# Altium schematic sheet Dongle.SchDoc
size A4
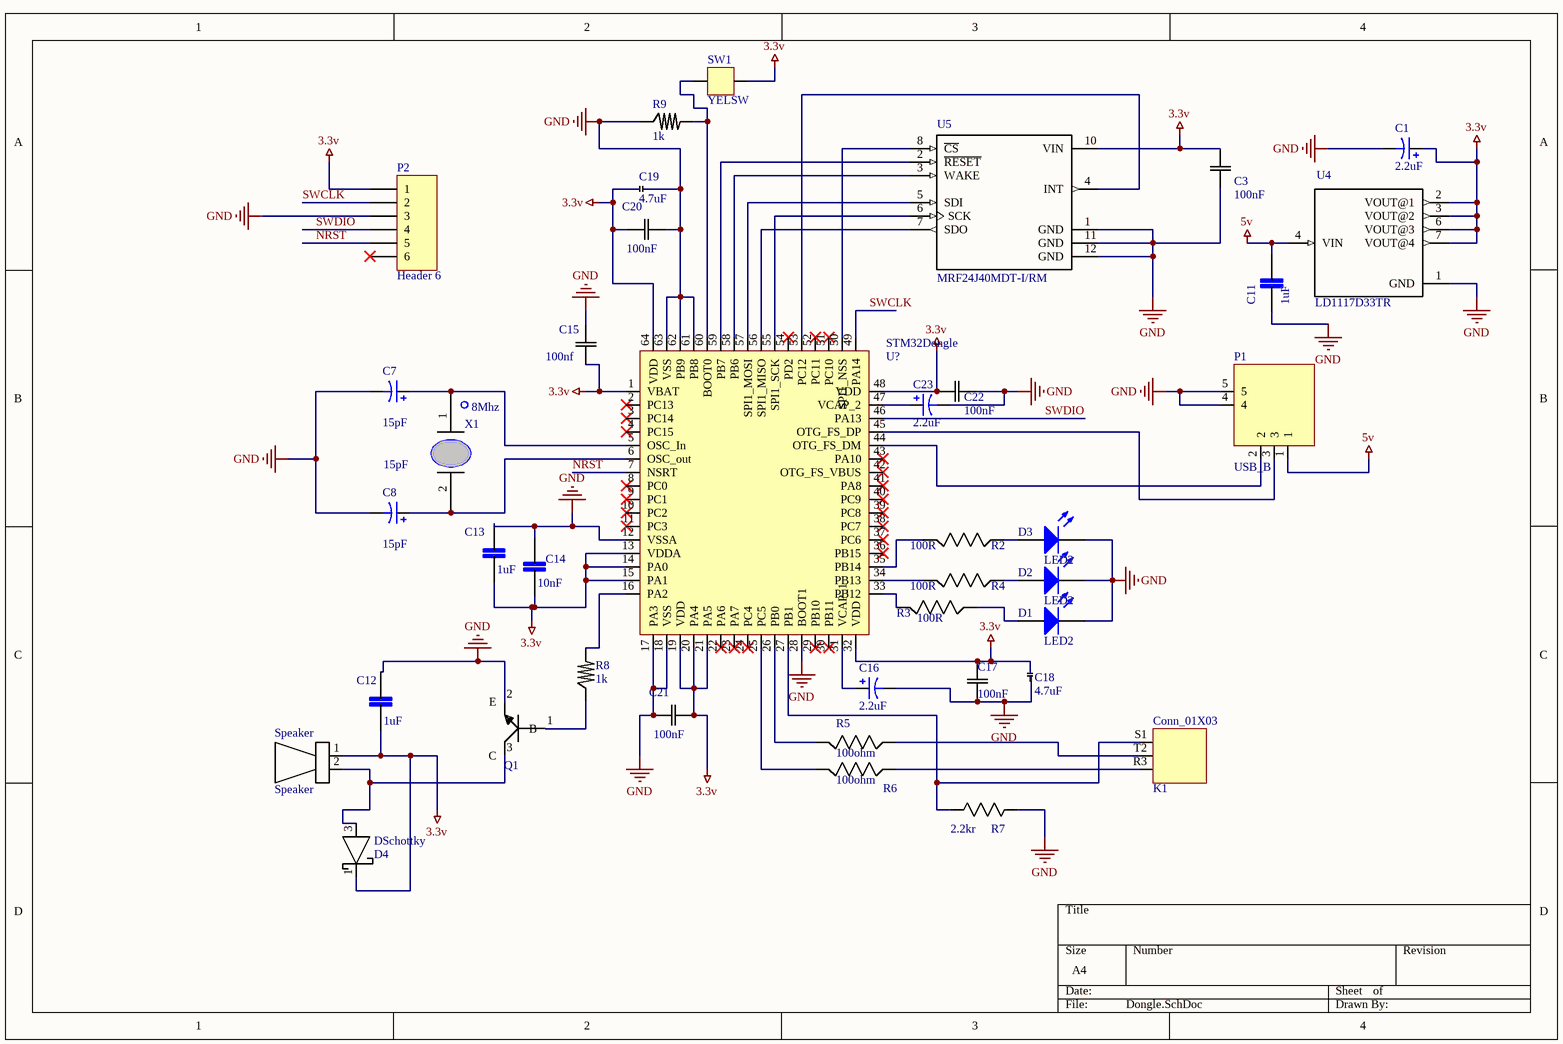
[diagram p0: Dongle.SchDoc]

## Parts
8Mhz  X1  [XTAL_ABLS2-24.000MHZ-D4YF-T]
C1  value 2.2uF  [C0805]  (hidden comment: Cap Pol3)
C3  100nF  [CAPC2013X110N]
C7  15pF  [C0805]
C8  value 15pF  [C0805]  (hidden comment: Cap Pol3)
C11  1uF  [INDC2012X87N]
C12  1uF  [INDC2012X87N]
C13  1uF  [INDC2012X87N]
C14  10nF  [CAPC2012X135N]
C15  100nf  [CAPC2013X110N]
C16  value 2.2uF  [C0805]  (hidden comment: Cap Pol3)
C17  100nF  [CAPC2013X110N]
C18  4.7uF  [0805]
C19  4.7uF  [0805]
C20  100nF  [CAPC2013X110N]
C21  100nF  [CAPC2013X110N]
C22  100nF  [CAPC2013X110N]
C23  value 2.2uF  [C0805]  (hidden comment: Cap Pol3)
Conn_01X03  K1  [PCBComponent_1]
D1  LED2  [3.2X1.6X1.1]
D2  LED2  [3.2X1.6X1.1]
D3  LED2  [3.2X1.6X1.1]
DSchottky  D4  [SOT65P210X110-3N]
P1  USB_B  [PCBComponent_1]
P2  Header 6  [HDR1X6]
Q1  BC846A-7-F  [SOT23-3]  (value not drawn)
R2  100R  [RESC2012X60]
R3  100R  [RESC2012X60]
R4  100R  [RESC2012X60]
R5  100ohm  [RESC2012X60]
R6  100ohm  [RESC2012X60]
R7  2.2kr  [RESC2013X65N]
R8  1k  [CAPC2012X140N]
R9  1k  [CAPC2012X140N]
Speaker  Speaker  [Speaker]
STM32Dongle  U?  [QFP50P1200X1200X160-64N]
SW1  YELSW  [PCBComponent_1]
U4  LD1117D33TR  [SOIC127P600X175-8N]
U5  MRF24J40MDT-I/RM  [XCVR_MRF24J40MDT-I/RM]

## Nets
3.3v: C1.1 C3.1(C1) C12.1 C13.1 C14.1 C15.1(C1) C17.1(C1) C18.P1 C19.P1 C20.1(C1) C21.2(C2) C22.1(C1) DSchottky.1 P2.1 Speaker.1 STM32Dongle.1(VBAT) STM32Dongle.13(VDDA) STM32Dongle.14(PA0) STM32Dongle.15(PA1) STM32Dongle.19(VDD) STM32Dongle.20(PA4) STM32Dongle.21(PA5) STM32Dongle.32(VDD) STM32Dongle.48(VDD) STM32Dongle.64(VDD) SW1.3 U4.2(VOUT@1) U4.3(VOUT@2) U4.6(VOUT@3) U4.7(VOUT@4) U5.10(VIN)
5v: C11.2 P1.1 U4.4(VIN)
GND: C1.2 C3.2(C2) C7.2 C8.2 C11.1 C12.2 C13.2 C14.2 C15.2(C2) C16.2 C17.2(C2) C18.P2 C19.P2 C20.2(C2) C21.1(C1) C22.2(C2) C23.2 D1.2(K) D2.2(K) D3.2(K) P1.4 P1.5 P2.3 Q1.2(E) R7.1(R1) R9.1 STM32Dongle.12(VSSA) STM32Dongle.17(PA3) STM32Dongle.18(VSS) STM32Dongle.28(BOOT1) STM32Dongle.61(PB8) STM32Dongle.62(PB9) STM32Dongle.63(VSS) U4.1(GND) U5.1(GND) U5.11(GND) U5.12(GND)
NRST: P2.5 STM32Dongle.7(NSRT)
SWCLK: P2.2 STM32Dongle.49(PA14)
SWDIO: P2.4 STM32Dongle.46(PA13)
Net8Mhz_1: 8Mhz.1 C7.1 STM32Dongle.5(OSC_In)
Net8Mhz_2: 8Mhz.2 C8.1 STM32Dongle.6(OSC_out)
NetC16_1: C16.1 STM32Dongle.31(VCAP_1)
NetC23_1: C23.1 STM32Dongle.47(VCAP_2)
NetConn_01X03_R3: Conn_01X03.R3 R6.2
NetConn_01X03_S1: Conn_01X03.S1 R7.2(R2) STM32Dongle.27(PB1)
NetConn_01X03_T2: Conn_01X03.T2 R5.2
NetD1_1: D1.1(A) R3.2
NetD2_1: D2.1(A) R4.2
NetD3_1: D3.1(A) R2.2
NetDSchottky_3: DSchottky.3 Q1.3(C) Speaker.2
NetP1_2: P1.2 STM32Dongle.44(OTG_FS_DM)
NetP1_3: P1.3 STM32Dongle.45(OTG_FS_DP)
NetQ1_1: Q1.1(B) R8.1
NetR2_1: R2.1 STM32Dongle.35(PB14)
NetR3_1: R3.1 STM32Dongle.33(PB12)
NetR4_1: R4.1 STM32Dongle.34(PB13)
NetR5_1: R5.1 STM32Dongle.26(PB0)
NetR6_1: R6.1 STM32Dongle.25(PC5)
NetR8_2: R8.2 STM32Dongle.16(PA2)
NetR9_2: R9.2 STM32Dongle.60(BOOT0) SW1.1
NetSTM32Dongle_50: STM32Dongle.50(SPI1_NSS) U5.8(~{CS})
NetSTM32Dongle_53: STM32Dongle.53(PC12) U5.4(INT)
NetSTM32Dongle_55: STM32Dongle.55(SPI1_SCK) U5.6(SCK)
NetSTM32Dongle_56: STM32Dongle.56(SPI1_MISO) U5.7(SDO)
NetSTM32Dongle_57: STM32Dongle.57(SPI1_MOSI) U5.5(SDI)
NetSTM32Dongle_58: STM32Dongle.58(PB6) U5.3(WAKE)
NetSTM32Dongle_59: STM32Dongle.59(PB7) U5.2(~{RESET})

Not connected (* = marked no-connect by the designer): P2 6*; STM32Dongle 2(PC13)* 3(PC14)* 4(PC15)* 8(PC0)* 9(PC1)* 10(PC2)* 11(PC3)* 22(PA6)* 23(PA7)* 24(PC4)* 29(PB10)* 30(PB11)* 36(PB15)* 37(PC6)* 38(PC7)* 39(PC8)* 40(PC9)* 41(PA8)* 42(OTG_FS_VBUS)* 43(PA10)* 51(PC10)* 52(PC11)* 54(PD2)*

## Library data of the parts
8Mhz = 8Mhz
C1 C7 C8 C16 C23 = Cap Pol3: Polarized Capacitor (Surface Mount); Published: 8-Jun-2000; LatestRevisionDate: 29-May-2009; LatestRevisionNote: IPC-7351 Footprint Added.; PackageReference: C0805; Publisher: Altium Limited; PackageDescription: Chip Capacitor
  C7: Value: 15pF
C3 C15 C17 C20-C22 = C0805C104K5RACTU: Capacitor; Ceramic; Cap; .100UF ; Tol+-10%; SMD; Vol-Rtg 50V; X7R, Tape/Reel; MF: Kemet; Package: 0805 Kemet; Availability: Good; MP: C0805C104K5RACTU; Price: 0.86 USD; Value: *
C11-C13 = C2012X5R1E105M085AC: CAP CER 1UF 25V X5R 0805; MF: TDK; Availability: Good; Package: 0805 TDK; Price: 0.06 USD; MP: C2012X5R1E105M085AC; Value: *
C14 = GRM216R71H103KA01D: CAP CER 10000PF 50V X7R 0805; MF: Murata; Package: 0805 Murata; Digi-Key_Purchase_URL: https://www.digikey.ca/product-detail/en/murata-electronics-north-america/GRM216R71H103KA01D/490-1664-1-ND/587472?WT.z_cid=ref_snapeda&utm_source=snapeda&utm_medium=aggregator&utm_campaign=buynow; Digi-Key_Part_Number: 490-1664-1-ND; MP: GRM216R71H103KA01D; Value: *
Conn_01X03 = Conn_01X03
D1-D3 = LED2: Typical RED, GREEN, YELLOW, AMBER GaAs LED; Published: 8-Jun-2000; LatestRevisionDate: 17-Jul-2002; LatestRevisionNote: Re-released for DXP Platform.; PackageVersion: Feb-2002; PackageReference: 3.2X1.6X1.1; Publisher: Altium Limited; PackageDescription: SM LED; 2 Flat Leads
DSchottky = DSchottky
P1 Speaker = Component_1
P2 = Header 6: Header, 6-Pin; LatestRevisionDate: 17-Jul-2002; LatestRevisionNote: Re-released for DXP Platform.; Publisher: Altium Limited
Q1 = BC846A-7-F: TRANS NPN 65V 0.1A SOT23-3; MF: Diodes Inc.; Package: SOT-23-3 Diodes Inc.; MP: BC846A-7-F; Digi-Key_Purchase_URL: https://www.digikey.ca/product-detail/en/diodes-incorporated/BC846A-7-F/BC846A-7FDICT-ND/2181056?WT.z_cid=ref_snapeda&utm_source=snapeda&utm_medium=aggregator&utm_campaign=buynow; Digi-Key_Part_Number: BC846A-7FDICT-ND; Value: *
R2-R6 = RC0805FR-07100RL: RES SMD 100 OHM 1% 1/8W 0805; MF: Yageo; MP: RC0805FR-07100RL; Price: 0.01 USD; Package: 0805 Yageo; Availability: Good; Value: *
R7 = RC0805FR-072K2L: RES SMD 2.2K OHM 1% 1/8W 0805; MF: Yageo; MP: RC0805FR-072K2L; Price: 0.01 USD; Package: 0805 Yageo; Availability: Good; Value: *
R8 R9 = 1kohm: 1276-5272-1-ND
STM32Dongle = STM32Dongle: 497-11907-ND
U4 = LD1117D33TR: IC REG LINEAR 3.3V 800MA 8SO; MF: STMicroelectronics; Price: 0.24 USD; Package: SO-8 STMicroelectronics; Availability: Good; MP: LD1117D33TR; Value: *
U5 = MRF24J40MDT-I/RM: 2.4 GHz IEEE 802.15.4 Certified Transceiver Module (+20 dBm), 12 MODULE Varies T/R; MF: Microchip; Price: 14.78 USD; Availability: Good; MP: MRF24J40MDT-I/RM; Package: SMD-12 Microchip; Value: *